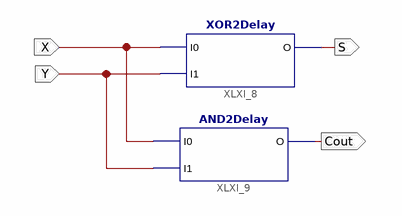
[diagram p0: schematic sheet 1]
// Xilinx ISE schematic HAdelay.sch (spartan6) as structural Verilog: 2 symbols, 4 ports
module HAdelay (
  input  X,
  input  Y,
  output S,
  output Cout
);

  XOR2Delay XLXI_8 (.I0(X), .I1(Y), .O(S));
  AND2Delay XLXI_9 (.I0(X), .I1(Y), .O(Cout));
endmodule
